# Altium schematic sheet 2s.SchDoc
size A3 portrait
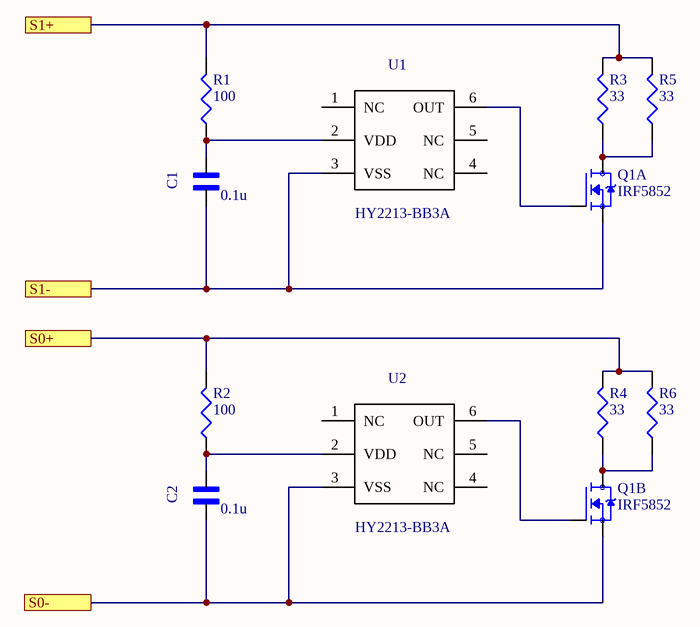
[diagram p0: 2s.SchDoc]

## Parts
C1  value 0.1u  [*CAPC1608X90]  (hidden comment: GX035C104MAT2-500)
C2  value 0.1u  [*CAPC1608X90]  (hidden comment: GX035C104MAT2-500)
Q1  IRF5852  [SOT23-6]  (parts A,B of 2)
R1  value 100  [J1-0603]  (hidden comment: Res3)
R2  value 100  [J1-0603]  (hidden comment: Res3)
R3  value 33  [12Z-2010]  (hidden comment: Res3)
R4  value 33  [12Z-2010]  (hidden comment: Res3)
R5  value 33  [12Z-2010]  (hidden comment: Res3)
R6  value 33  [12Z-2010]  (hidden comment: Res3)
U1  HY2213-BB3A  [sot23-6]
U2  HY2213-BB3A  [sot23-6]

## Ports
S0+, S0-, S1+, S1-

## Nets
S0+: R2.2 R4.2 R6.2 ; port S0+
S0-: C2.2 Q1.4(S) U2.3(VSS) ; port S0-
S1+: R1.2 R3.2 R5.2 ; port S1+
S1-: C1.2 Q1.5(S) U1.3(VSS) ; port S1-
NetC1_1: C1.1 R1.1 U1.2(VDD)
NetC2_1: C2.1 R2.1 U2.2(VDD)
NetQ1_1: Q1.1(G) U1.6(OUT)
NetQ1_2: Q1.2(D) R4.1 R6.1
NetQ1_3: Q1.3(G) U2.6(OUT)
NetQ1_6: Q1.6(D) R3.1 R5.1

Not connected (* = marked no-connect by the designer): U1 1(NC) 4(NC) 5(NC); U2 1(NC) 4(NC) 5(NC)

## Notes on the sheet
- Title
- Size:
- Date:
- A3
- Number:
- Time:
- Revision:
- Sheet
- of
- File:

## Library data of the parts
C1 C2 = GX035C104MAT2-500: Cap Thin Film 0.1uf 50v 0603; MF: AVX; MP: GX035C104MAT2-500 or CL10B104JB8NNNC; Pacage Metric: 1608; Type: SMD; Package: 0603 AVX; SnapEDA_Link: https://www.snapeda.com/parts/GX035C104MAT2-500/AVX/view-part/?ref=snap
Q1 = IRF5852: Mosfet Array 2 N-Channel _Dual_ 20V 2.7A 960mW Surface Mount 6-TSOP; MF: Infineon; Price: None; Availability: Unavailable; Value: *; MP: IRF5852; SnapEDA_Link: https://www.snapeda.com/parts/IRF5852/Infineon%20Technologies/view-part/593138/?ref=snap; Package: TSOP-6 International Rectifier; ChipDip_Link: https://www.chipdip.ru/product/irf5852trpbf; HelpURL: https://static.chipdip.ru/lib/300/DOC000300076.pdf
R1-R6 = Res3: Resistor; Published: 8-Jun-2000; LatestRevisionDate: 29-May-2009; LatestRevisionNote: IPC-7351 Footprint Added.; PackageReference: J1-0603; Publisher: Altium Limited; PackageDescription: Chip Resistor
U1 U2 = HY2213-BB3A: MF: infineon; MP: IRS10752LTRPBF; Availability: Unavailable; Package: SOT-23-6; Price: None; SnapEDA_Link: https://www.snapeda.com/parts/IRS10752LTRPBF/Infineon%20Technologies/view-part/?ref=search&t=IRS10752; Value: *; HelpURL: http://www.hycontek.com/wp-content/uploads/DS-HY2213_EN.pdf; ChipDip_Link: http://www.hycontek.com/wp-content/uploads/DS-HY2213_EN.pdf